# Altium schematic sheet DriverControlsMezzanine.SchDoc: Mezzanine Pinout
size Letter; Author: Norman Chong; Revision: 1.19; SheetNumber: 1; SheetTotal: 2; Website: www.uwmidsun.com; ProjectName: Driver Controls
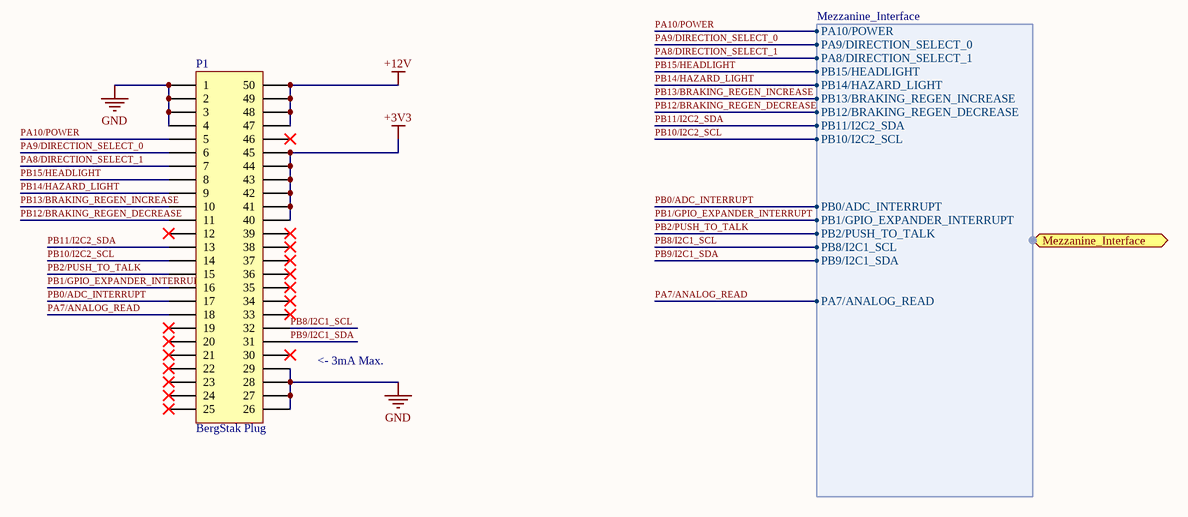
[diagram p0: DriverControlsMezzanine.SchDoc]

## Parts
P1  Series: BergStak Plug  [CONN, Bergstak 50 Pos Plug]  (hidden comment: CONN 50POS Bergstak Plug 0.02")

## Ports
Mezzanine_Interface (harness Mezzanine_Interface)

## Harnesses
Mezzanine_Interface: PA10/POWER, PA9/DIRECTION_SELECT_0, PA8/DIRECTION_SELECT_1, PB15/HEADLIGHT, PB14/HAZARD_LIGHT, PB13/BRAKING_REGEN_INCREASE, PB12/BRAKING_REGEN_DECREASE, PB10/I2C2_SCL, PB8/I2C1_SCL, PB9/I2C1_SDA, PB2/PUSH_TO_TALK, PB0/ADC_INTERRUPT, PB1/GPIO_EXPANDER_INTERRUPT, PB11/I2C2_SDA, PA7/ANALOG_READ

## Nets
+3V3: P1.40 P1.41 P1.42 P1.43 P1.44 P1.45
+12V: P1.47 P1.48 P1.49 P1.50
GND: P1.1 P1.2 P1.3 P1.4 P1.26 P1.27 P1.28 P1.29
PA7/ANALOG_READ: P1.18 ; port Mezzanine_Interface.PA7/ANALOG_READ
PA8/DIRECTION_SELECT_1: P1.7 ; port Mezzanine_Interface.PA8/DIRECTION_SELECT_1
PA9/DIRECTION_SELECT_0: P1.6 ; port Mezzanine_Interface.PA9/DIRECTION_SELECT_0
PA10/POWER: P1.5 ; port Mezzanine_Interface.PA10/POWER
PB0/ADC_INTERRUPT: P1.17 ; port Mezzanine_Interface.PB0/ADC_INTERRUPT
PB1/GPIO_EXPANDER_INTERRUPT: P1.16 ; port Mezzanine_Interface.PB1/GPIO_EXPANDER_INTERRUPT
PB2/PUSH_TO_TALK: P1.15 ; port Mezzanine_Interface.PB2/PUSH_TO_TALK
PB8/I2C1_SCL: P1.32 ; port Mezzanine_Interface.PB8/I2C1_SCL
PB9/I2C1_SDA: P1.31 ; port Mezzanine_Interface.PB9/I2C1_SDA
PB10/I2C2_SCL: P1.14 ; port Mezzanine_Interface.PB10/I2C2_SCL
PB11/I2C2_SDA: P1.13 ; port Mezzanine_Interface.PB11/I2C2_SDA
PB12/BRAKING_REGEN_DECREASE: P1.11 ; port Mezzanine_Interface.PB12/BRAKING_REGEN_DECREASE
PB13/BRAKING_REGEN_INCREASE: P1.10 ; port Mezzanine_Interface.PB13/BRAKING_REGEN_INCREASE
PB14/HAZARD_LIGHT: P1.9 ; port Mezzanine_Interface.PB14/HAZARD_LIGHT
PB15/HEADLIGHT: P1.8 ; port Mezzanine_Interface.PB15/HEADLIGHT

Not connected (* = marked no-connect by the designer): P1 12* 19* 20* 21* 22* 23* 24* 25* 30* 33* 34* 35* 36* 37* 38* 39* 46*

## Notes on the sheet
- <- 3mA Max.
- Project:
- Title:
- Size:
- Project Lead:
- Letter
- Revision:
- University of Waterloo
- 200 University Ave W
- Waterloo, ON, Canada
- N2L 3E9
- Date:
- Sheet
- of
- Website:

## Library data of the parts
P1 = CONN 50POS Bergstak Plug 0.02": 50 Position Connector Plug, Outer Shroud Contacts Surface Mount Gold; Manufacturer 1: Amphenol FCI; Manufacturer Part Number 1: 10132797-055100LF; Number of Positions: 50; Mated Stacking Heights: 5mm; Pitch: 0.020" (0.50mm); Supplier 1: Digi-Key; Supplier Part Number 1: 609-5226-1-ND; Packaging: Cut Tape (CT); Part Status: Active; Connector Type: Plug, Outer Shroud Contacts; Number of Rows: 2; Mounting Type: Surface Mount; Contact Finish: Gold; Contact Finish Thickness: 1µin (0.025µm); Height Above Board: 0.169" (4.30mm); ComponentLink1URL: http://portal.fciconnect.com/Comergent//fci/drawing/10132797.pdf; ComponentLink1Description: http://portal.fciconnect.com/Comergent//fci/drawing/10132797.pdf